# EasyEDA Pro project zdiy1.eprj, board PCB1
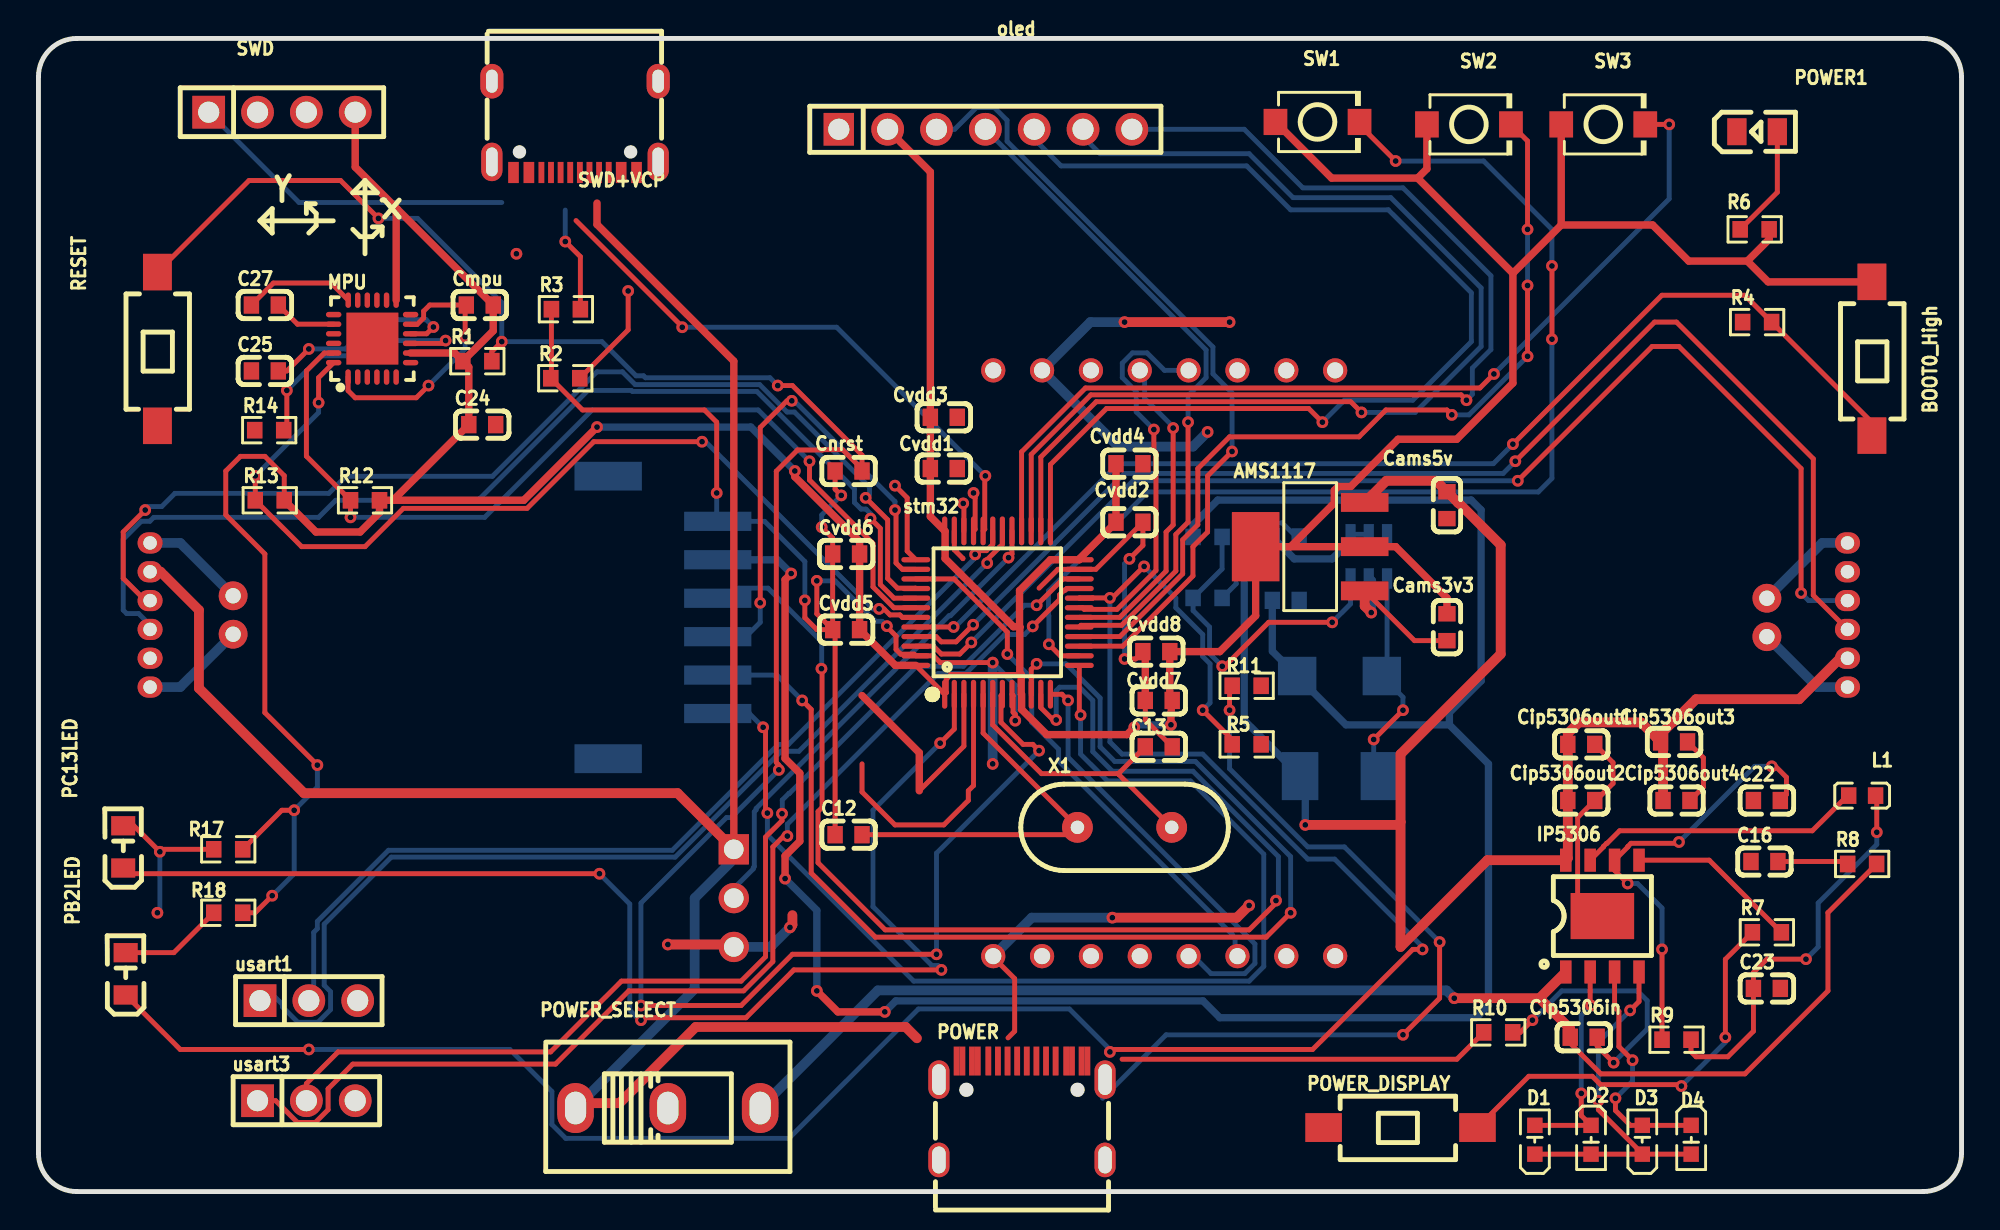
[diagram p2: board, top side]
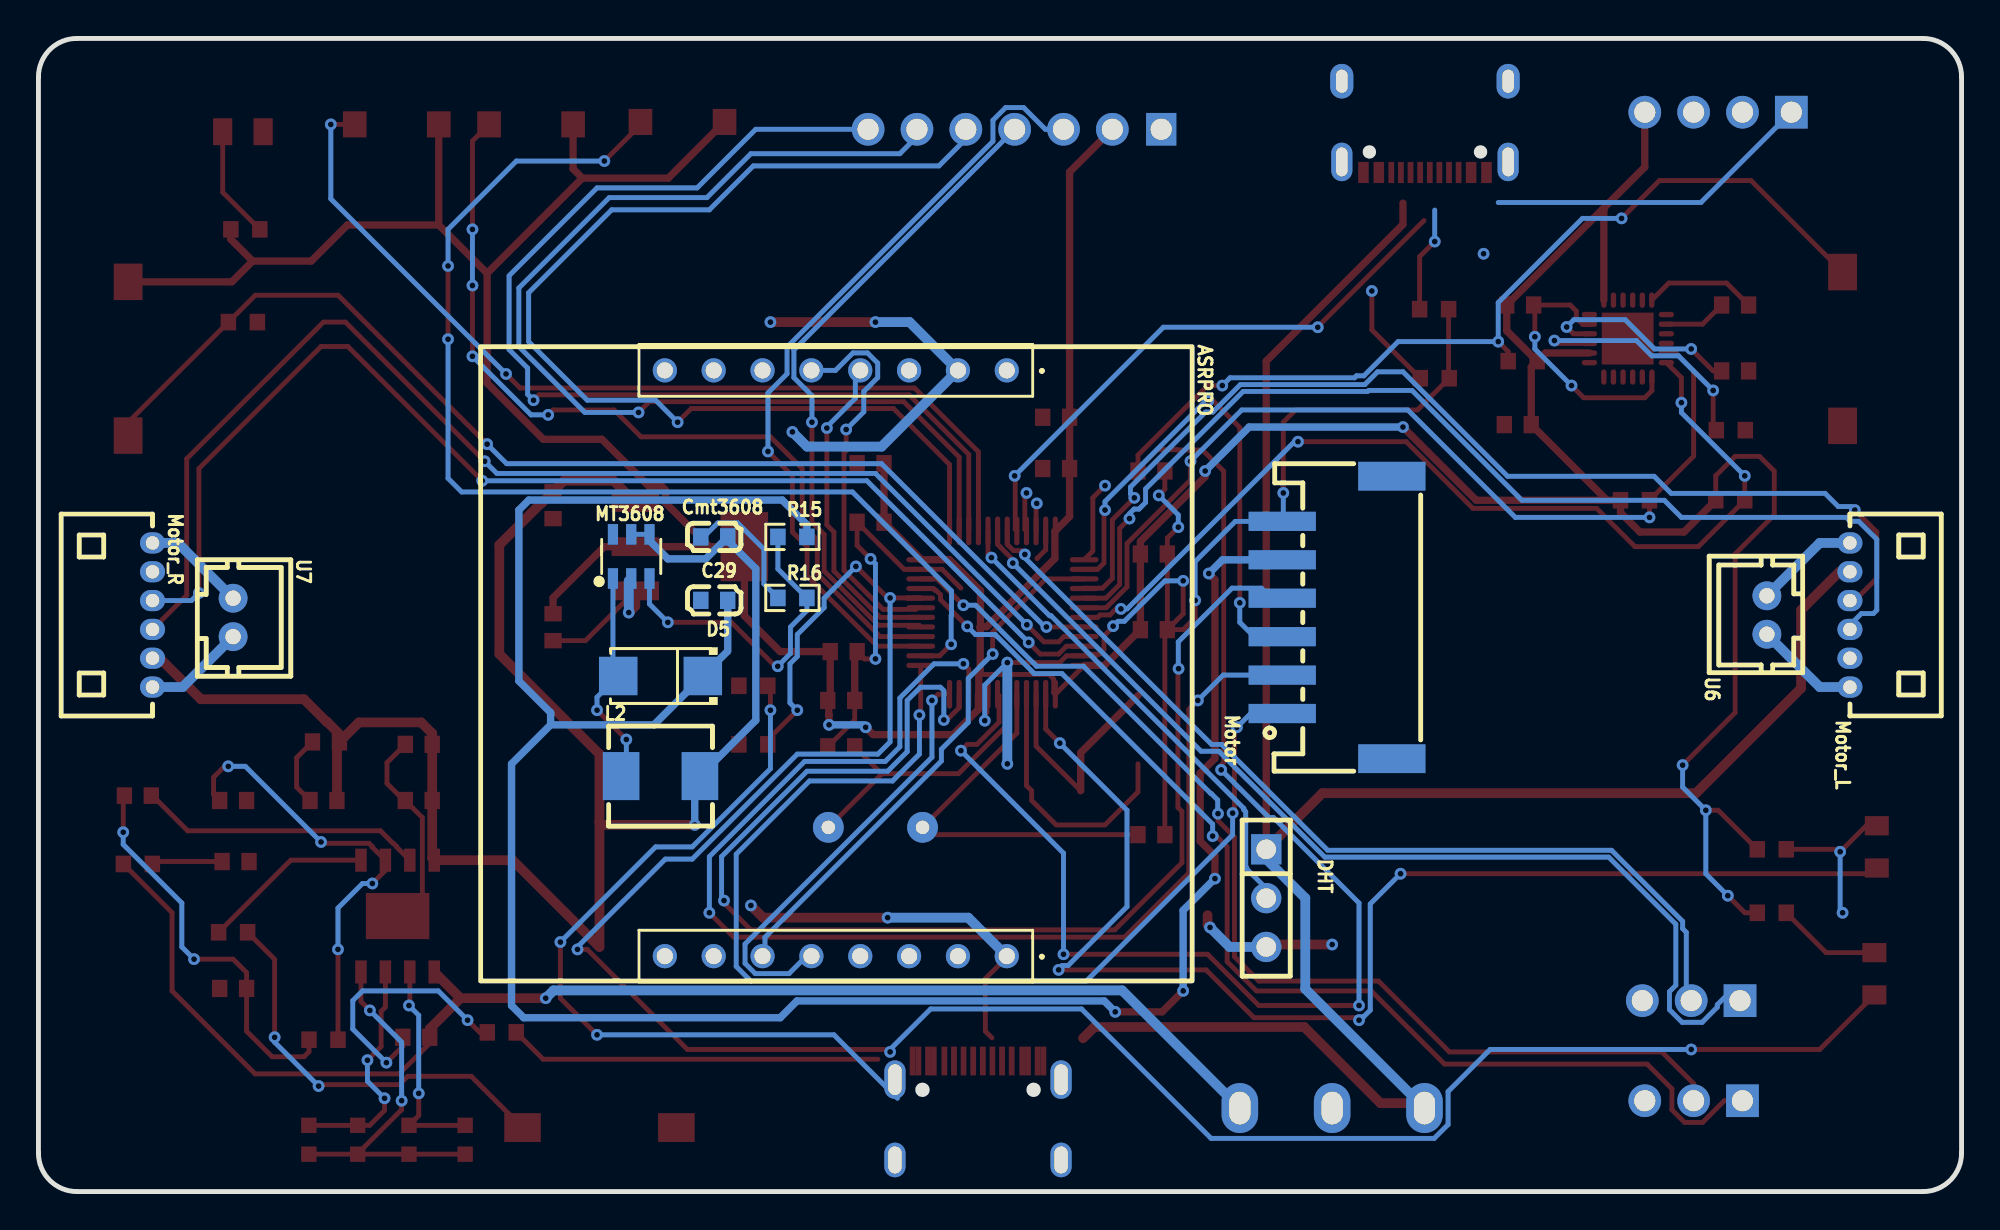
[diagram p3: board, bottom side, seen from below]

Outline 100 x 60 mm; copper layers: Top Layer, Bottom Layer. Coordinates in mm from the lower left corner of the outline.
Outline path: 0,58 0,2 arc(0.59,0.59) 2,0 98,0 arc(99.41,0.59) 100,2 100,58 arc(99.41,59.41) 98,60 2,60 arc(0.59,59.41) 0,58
Stack: Top Layer 0.035mm / Dielectric1 1.51mm FR4 er 4.5 / Bottom Layer 0.035mm

## Design rules (mm)
template: 自定义配置
spacing copperThickness1oz (default): track to track 0.102, other pairs 0.152 to 0.3
spacing copperThickness2oz: track to track 0.203, other pairs 0.152 to 0.3
track width copperThickness1oz (default): min 0.127, default 0.254, max 2.54
track width copperThickness2oz: min 0.203, default 0.254, max 2.54
differential pair differentialPair (default): width min 0.127, default 0.254, max 2.54; gap min 0.152, default 0.152
via viaSize (default): diameter min 0.5, default 0.61, max 10; hole min 0.3, default 0.305, max 6.3
net GND uses copperRegion2

## Placement (name value [footprint] x y rotation side)
AMS1117  AMS1117-3.3  [SOT-223-4_L6.5-W3.5-P2.30-LS7.0-BR]  66.13 33.56 0 top
ASRPRO  ASRPRO  [asrpro_fz]  58.51 27.46 270 bottom
BOOT0_High  TS-1101-C-W  [SW-SMD_L6.0-W3.3-LS8.0]  95.34 43.33 90 top
C12  20pF  [C0603]  42.13 18.57 0 top
C13  20pF  [C0603]  58.25 23.14 180 top
C16  10uF  [C0603]  89.75 17.17 0 top
C22  22uF  [C0603]  89.88 20.35 0 top
C23  22uF  [C0603]  89.88 10.57 0 top
C24  10pF  [C0603]  23.08 39.91 0 top
C25  100pF  [C0603]  11.77 42.7 0 top
C27  2.2uF  [C0603]  11.77 46.13 0 top
C29  22uF  [C0603]  64.86 30.76 180 bottom
Cams3v3  100nF  [C0603]  73.24 29.36 270 top
Cams5v  100nF  [C0603]  73.24 35.72 270 top
Cip5306in  10uF  [C0603]  80.35 8.03 180 top
Cip5306out1  22uF  [C0603]  80.23 23.27 0 top
Cip5306out2  22uF  [C0603]  80.23 20.35 0 top
Cip5306out3  22uF  [C0603]  85.05 23.4 0 top
Cip5306out4  22uF  [C0603]  85.18 20.35 0 top
Cmpu  100pF  [C0603]  22.95 46.13 0 top
Cmt3608  22uF  [C0603]  64.86 34.06 180 bottom
Cnrst  100nF  [C0603]  42.13 37.49 180 top
Cvdd1  100nF  [C0603]  47.08 37.62 180 top
Cvdd2  100nF  [C0603]  56.73 34.83 180 top
Cvdd3  100nF  [C0603]  47.08 40.29 180 top
Cvdd4  100nF  [C0603]  56.73 37.87 180 top
Cvdd5  100nF  [C0603]  42 29.24 0 top
Cvdd6  4.7uF  [C0603]  42 33.17 0 top
Cvdd7  1uF  [C0603]  58.25 25.56 0 top
Cvdd8  10nF  [C0603]  58.13 28.09 180 top
D1  XL-J1608UGC-06  [LED-SMD_XL-J1608UYC-06]  77.81 2.69 270 top
D2  XL-J1608UGC-06  [LED-SMD_XL-J1608UYC-06]  80.73 2.69 90 top
D3  XL-J1608UGC-06  [LED-SMD_XL-J1608UYC-06]  83.4 2.69 270 top
D4  XL-J1608UGC-06  [LED-SMD_XL-J1608UYC-06]  85.94 2.69 90 top
D5  SS34  [SMA_L4.3-W2.6-LS5.2-RD]  67.65 26.83 0 bottom
DHT  PM254V-11-03-H85  [HDR-TH_3P-P2.54-V-F]  36.16 15.27 270 bottom
IP5306  IP5306  [ESOP-8_L4.9-W3.9-P1.27-LS6.0-BL-EP]  81.32 14.33 0 top
L1  1uH  [L0603]  94.83 20.6 0 top
L2  4.7uH  [IND-SMD_L5.4-W5.2_FXL0530]  67.65 21.62 180 bottom
Motor  WAFER-PH2.0-6PWB  [CONN-SMD_6P-P2.00_XUNPU_WAFER-PH2.0-6PWB]  32.47 29.87 90 bottom
Motor_L  HC-ZH1.5-6AW  [CONN-TH_6P-P1.50_HCTL_C-ZH1.5-6AW]  5.8 30 90 bottom
Motor_R  HC-ZH1.5-6AW  [CONN-TH_6P-P1.50_HCTL_C-ZH1.5-6AW]  94.07 30 270 bottom
MPU  MPU-6050  [QFN-24_L4.0-W4.0-P0.50-BL-EP2.7]  17.35 44.38 0 top
MT3608  MT3608  [SOT-23-6_L2.9-W1.6-P0.95-LS2.8-BL]  69.18 33.05 180 bottom
oled  PM254V-11-07-H85  [HDR-TH_7P-P2.54-V-F]  49.24 55.27 0 top
PB2LED  XL-2012UBC  [LED0805-RD]  4.53 11.33 90 top
PC13LED  XL-2012UBC  [LED0805-RD]  4.41 17.94 90 top
POWER  TYPE-C母座16P不绣钢  [TYPE-C-SMD_16P-EH4]  51.14 4.22 0 top
POWER1  NCD0805R1  [LED0805-R-RD]  89.37 55.15 0 top
POWER_DISPLAY  TS-1101-C-W  [SW-SMD_L6.0-W3.3-LS8.0]  70.83 3.33 0 top
POWER_SELECT  SS-12D10G3-G  [SW-TH_3P-L12.7-W6.7-P4.80_SS-12D10G10-G]  32.73 4.35 0 top
R1  5.1K  [R0603]  22.82 43.21 0 top
R2  4.3kΩ  [R0603]  27.39 42.32 0 top
R3  3.9kΩ  [R0603]  27.43 45.91 0 top
R4  4.7kΩ  [R0603]  89.37 45.24 0 top
R5  4.7kΩ  [R0603]  62.83 23.27 180 top
R6  4.7kΩ  [R0603]  89.24 50.07 180 top
R7  10kΩ  [R0603]  89.88 13.49 0 top
R8  2Ω  [R0603]  94.83 17.05 0 top
R9  500mΩ  [R0603]  85.18 7.9 0 top
R10  5.1kΩ  [R0603]  75.91 8.28 0 top
R11  5.1kΩ  [R0603]  62.83 26.32 180 top
R12  4.7kΩ  [R0603]  16.98 35.97 0 top
R13  4.7kΩ  [R0603]  12.03 35.97 0 top
R14  4.7kΩ  [R0603]  12 39.62 0 top
R15  9kΩ  [R0603]  60.79 34.06 180 bottom
R16  1kΩ  [R0603]  60.79 30.89 180 bottom
R17  4.7kΩ  [R0603]  9.87 17.81 180 top
R18  4.7kΩ  [R0603]  9.87 14.51 180 top
RESET  TS-1101-C-W  [SW-SMD_L6.0-W3.3-LS8.0]  6.19 43.84 90 top
stm32  STM32F103C8T6  [LQFP-48_L7.0-W7.0-P0.50-LS9.0-BL]  49.87 30.13 0 top
SW1  TS-1088R-02026  [SW-SMD_L3.9-W3.0-P4.45]  66.51 55.65 0 top
SW2  TS-1088R-02026  [SW-SMD_L3.9-W3.0-P4.45]  74.38 55.53 0 top
SW3  TS-1088R-02026  [SW-SMD_L3.9-W3.0-P4.45]  81.37 55.53 0 top
SWD  2.54-1*4P母  [HDR-TH_4P-P2.54-V-F]  12.66 56.16 0 top
SWD+VCP  TYPE-C 16PIN 2MD(073)  [USB-C-SMD_TYPE-C-6PIN-2MD-073]  27.9 55.4 180 top
U6  WAFER-PH2.0-2PZZ  [CONN-TH_2P-P2.00_HC-PH-2A-M]  10.12 30 90 bottom
U7  WAFER-PH2.0-2PZZ  [CONN-TH_2P-P2.00_HC-PH-2A-M]  89.88 29.87 270 bottom
usart1  PZ254V-11-03P  [HDR-TH_3P-P2.54-V-M]  14.06 9.93 0 top
usart3  PZ254V-11-03P  [HDR-TH_3P-P2.54-V-M]  13.93 4.73 0 top
X1  8MHz  [OSC-TH_L10.0-W4.5-P5.00]  56.48 18.95 90 top

## Footprints (pads in the part's own frame, mm; a bottom-side part is the same pattern mirrored in y, then rotated)
asrpro_fz
  round 1.26 hole 0.84: 1(-15.269,8.861) 2(-15.269,6.321) 3(-15.269,3.781) 4(-15.269,1.241) 5(-15.269,-1.299) 6(-15.269,-3.839) 7(-15.269,-6.379) 8(-15.269,-8.919) 9(15.211,-8.919) 10(15.211,-6.379) 11(15.211,-3.839) 12(15.211,-1.299) 13(15.211,1.241) 14(15.211,3.781) 15(15.211,6.321) 16(15.211,8.861)
C0603
  rect 0.8x0.9 smd: 1(-0.7,0) 2(0.7,0)
CONN-SMD_6P-P2.00_XUNPU_WAFER-PH2.0-6PWB
  rect 1x3.5 smd: 1(-5,2.85) 2(-3,2.85) 3(-1,2.85) 4(1,2.85) 5(3,2.85) 6(5,2.85)
  rect 1.5x3.5 smd: 7(-7.35,-2.85) 8(7.35,-2.85)
CONN-TH_2P-P2.00_HC-PH-2A-M
  round 1.5 hole 0.8: 1(-1,0) 2(1,0)
CONN-TH_6P-P1.50_HCTL_C-ZH1.5-6AW
  oval 1.1x1.3 hole 0.7: 1(-3.75,0) 2(-2.25,0) 3(-0.75,0) 4(0.75,0) 5(2.25,0) 6(3.75,0)
ESOP-8_L4.9-W3.9-P1.27-LS6.0-BL-EP
  rect 0.6x1.2 smd: 1(-1.905,-2.909) 2(-0.635,-2.909) 3(0.635,-2.909) 4(1.905,-2.909) 5(1.905,2.909) 6(0.635,2.909) 7(-0.635,2.909) 8(-1.905,2.909)
  rect 3.3x2.4 smd: 9(0,0)
HDR-TH_3P-P2.54-V-F
  rect 1.575x1.575 hole 1.02: 1(-2.54,0)
  round 1.575 hole 1.02: 2(0,0) 3(2.54,0)
HDR-TH_3P-P2.54-V-M
  rect 1.7x1.7 hole 1.1: 1(-2.54,0)
  round 1.7 hole 1.1: 2(0,0) 3(2.54,0)
HDR-TH_4P-P2.54-V-F
  rect 1.7x1.7 hole 1.1: 1(-3.81,0)
  round 1.7 hole 1.1: 2(-1.27,0) 3(1.27,0) 4(3.81,0)
HDR-TH_7P-P2.54-V-F
  rect 1.575x1.7 hole 1.1: 1(-7.62,0)
  round 1.7 hole 1.1: 2(-5.08,0) 3(-2.54,0) 4(0,0) 5(2.54,0) 6(5.08,0) 7(7.62,0)
IND-SMD_L5.4-W5.2_FXL0530
  rect 1.9x2.5 smd: 1(-2.05,0) 2(2.05,0)
L0603
  rect 0.8x0.864 smd: 1(-0.7,0) 2(0.7,0)
LED0805-R-RD
  rect 1x1.399 smd: 1(1.05,0) 2(-1.05,0)
LED0805-RD
  rect 1x1.25 smd: 1(-1.1,0) 2(1.1,0)
LED-SMD_XL-J1608UYC-06
  rect 0.8x0.8 smd: 1(0.75,0) 2(-0.75,0)
LQFP-48_L7.0-W7.0-P0.50-LS9.0-BL
  oval 0.27x1.5 smd: 1(-2.75,-4.25) 2(-2.25,-4.25) 3(-1.75,-4.25) 4(-1.25,-4.25) 5(-0.75,-4.25) 6(-0.25,-4.25) 7(0.25,-4.25) 8(0.75,-4.25) 9(1.25,-4.25) 10(1.75,-4.25) 11(2.25,-4.25) 12(2.75,-4.25) 25(2.75,4.25) 26(2.25,4.25) 27(1.75,4.25) 28(1.25,4.25) 29(0.75,4.25) 30(0.25,4.25) 31(-0.25,4.25) 32(-0.75,4.25) 33(-1.25,4.25) 34(-1.75,4.25) 35(-2.25,4.25) 36(-2.75,4.25)
  oval 1.5x0.27 smd: 13(4.25,-2.75) 14(4.25,-2.25) 15(4.25,-1.75) 16(4.25,-1.25) 17(4.25,-0.75) 18(4.25,-0.25) 19(4.25,0.25) 20(4.25,0.75) 21(4.25,1.25) 22(4.25,1.75) 23(4.25,2.25) 24(4.25,2.75) 37(-4.25,2.75) 38(-4.25,2.25) 39(-4.25,1.75) 40(-4.25,1.25) 41(-4.25,0.75) 42(-4.25,0.25) 43(-4.25,-0.25) 44(-4.25,-0.75) 45(-4.25,-1.25) 46(-4.25,-1.75) 47(-4.25,-2.25) 48(-4.25,-2.75)
OSC-TH_L10.0-W4.5-P5.00
  round 1.6 hole 0.7: 1(0,2.45) 2(0,-2.45)
QFN-24_L4.0-W4.0-P0.50-BL-EP2.7
  oval 0.28x0.8 smd: 1(-1.25,-2) 2(-0.75,-2) 3(-0.25,-2) 4(0.25,-2) 5(0.75,-2) 6(1.25,-2) 13(1.25,2) 14(0.75,2) 15(0.25,2) 16(-0.25,2) 17(-0.75,2) 18(-1.242,2)
  oval 0.8x0.28 smd: 7(2,-1.25) 8(2,-0.75) 9(2,-0.25) 10(2,0.25) 11(2,0.75) 12(2,1.25) 19(-2,1.25) 20(-2,0.75) 21(-2,0.25) 22(-2,-0.25) 23(-2,-0.75) 24(-2,-1.25)
  rect 2.7x2.7 smd: 25(0.013,0)
R0603
  rect 0.806x0.864 smd: 1(-0.753,0) 2(0.753,0)
SMA_L4.3-W2.6-LS5.2-RD
  rect 2x2 smd: 1(-2.2,0) 2(2.2,0)
SOT-23-6_L2.9-W1.6-P0.95-LS2.8-BL
  rect 0.532x1.072 smd: 1(-0.95,-1.149) 2(0,-1.149) 3(0.95,-1.149) 4(0.95,1.149) 5(0,1.149) 6(-0.95,1.149)
SOT-223-4_L6.5-W3.5-P2.30-LS7.0-BR
  rect 2.47x0.98 smd: 1(2.835,-2.3) 2(2.835,0) 3(2.835,2.3)
  rect 2.47x3.6 smd: 4(-2.835,0)
SW-SMD_L3.9-W3.0-P4.45
  rect 1.23x1.36 smd: 1(-2.185,0) 2(2.185,0)
SW-SMD_L6.0-W3.3-LS8.0
  rect 1.9x1.5 smd: 1(-4,0) 2(4,0)
SW-TH_3P-L12.7-W6.7-P4.80_SS-12D10G10-G
  oval 1.9x2.6 hole 1.1x1.7: 1(-4.8,0) 2(0,0) 3(4.8,0)
TYPE-C-SMD_16P-EH4
  oval 1.1x2 hole 0.7x1.6: 1(-4.32,1.606) 1(4.32,1.606)
  oval 1.1x1.8 hole 0.7x1.4: 1(-4.32,-2.574) 1(4.32,-2.574)
  rect 0.3x1.5 smd: A1(-3.4,2.573) A4(-2.6,2.573) A5(-1.25,2.573) A6(-0.25,2.573) A7(0.25,2.573) A8(1.25,2.574) A9(2.6,2.574) A12(3.4,2.573) B1(3.1,2.573) B4(2.3,2.574) B5(1.75,2.573) B6(0.75,2.573) B7(-0.75,2.573) B8(-1.75,2.574) B9(-2.3,2.573) B12(-3.1,2.573)
USB-C-SMD_TYPE-C-6PIN-2MD-073
  rect 0.55x1.1 smd: 1(-3.2,2.375) 2(-2.4,2.375) 11(2.4,2.375) 12(3.2,2.375)
  rect 0.3x1.1 smd: 3(-1.75,2.375) 4(-1.25,2.375) 5(-0.75,2.375) 6(-0.25,2.375) 7(0.25,2.375) 8(0.75,2.375) 9(1.25,2.375) 10(1.75,2.375)
  oval 1.1x2 hole 0.6x1.5: 13(-4.325,1.825) 14(4.325,1.825)
  oval 1.2x1.8 hole 0.6x1.2: 13(-4.325,-2.375) 14(4.325,-2.375)

## Nets
As in the schematic.

Pads without a net: ASRPRO 1 3 6 7 8 9 10 13 14; Motor 7 8; MPU 2 3 4 5 6 7 12 14 15 16 17 19 21 22 25; MT3608 6; POWER A6 A7 A8 B6 B7 B8

## Via types
v1: diameter 0.61, hole 0.305, Top Layer to Bottom Layer, 142 vias

## Routing (per net, layer and track width the routed paths; a pad name or vN(x,y) marks a point on that pad's centre or on a via; arc(x,y) is an arc through that point)
3V3: length 265.5
  Top Layer w0.254: v1(12.15,15.39) 11.27,14.51 R18.1 ; 47.21,25.96 47.04,25.96 stm32.48 ; 47.21,25.96 stm32.1 ; 47.21,25.96 47.21,25.97 47.21,26.66 47.45,26.91 51.1,26.91 ; R13.2 12.78,37.25 11.77,38.25 10.5,38.25 9.74,37.49 9.74,35.21 11.77,33.17 11.77,24.92 v1(14.5,22.19) ; R17.1 12.65,19.84 v1(13.3,19.84)
  Top Layer w0.381: 18.44,35.97 R12.2 17.73,35.33 16.73,34.32 14.43,34.32 R13.2 ; 18.44,35.97 C24.1 22.38,42.9 R1.1 ; 18.44,35.97 25.23,35.97 v1(29.04,39.78) ; 65.11,33.56 AMS1117.4 63.29,29.96 61.43,28.09 Cvdd8.1 58.83,25.68 ; 65.11,33.56 67.39,35.83 67.39,36.49 67.59,36.69 68.25,36.69 70.7,39.14 73.75,39.14 76.67,42.06 76.67,47.78 ; 65.11,33.56 AMS1117.2 70.57,33.56 73.24,30.89 Cams3v3.1 ; R1.1 21.64,43.63 MPU.8 ; R1.1 23.65,44.79 Cmpu.2 18.66,51.12 ; 71.72,52.73 76.67,47.78 ; 71.72,52.73 67.25,52.73 SW1.1 ; 71.72,52.73 72.2,53.22 72.2,55.53 ; 76.67,47.78 79.18,50.29 ; 18.66,51.12 16.47,53.31 SWD.4 ; 18.66,51.12 18.6,51.06 MPU.13 ; 51.1,25.9 51.1,26.91 51.03,26.98 51.03,29.36 ; v1(39.33,37.49) 39.33,37.19 42.7,33.83 42.7,29.24 44.56,27.38 stm32.48 ; 88.86,48.42 85.81,48.42 83.94,50.29 79.18,50.29 ; 88.86,48.42 89.94,47.33 BOOT0_High.2 ; 88.86,48.42 90,49.55 R6.1 ; Cvdd4.2 Cvdd2.2 54.12,32.92 stm32.24 52.62,32.88 51.02,31.27 51.02,29.39 ; SW3.1 79.18,50.29 ; 51.03,29.36 51.03,29.38 51.02,29.39 ; 51.03,29.36 51.02,29.39 ; 58.91,25.51 58.91,24.81 58.89,24.79 v1(58.89,24.28) ; stm32.9 51.12,25.09 52.43,23.78 56.6,23.78 v1(56.99,24.16) ; 51.02,29.39 50.69,29.39 47.15,32.94 47.15,34.35 stm32.36 46.38,35.12 Cvdd1.2 Cvdd3.2 46.38,53.05 oled.2
  Bottom Layer w0.254: v1(14.5,22.19) 14.5,21.05 v1(13.3,19.84) 13.3,16.54 v1(12.15,15.39)
  Bottom Layer w0.381: v1(58.89,24.28) 57.11,24.28 v1(56.99,24.16) ; v1(29.04,39.78) 37.05,39.78 v1(39.33,37.49)
6V: length 120.6
  Top Layer w0.381: v1(38.82,16.28) 38.82,17.46 39.59,18.23 39.59,21.77 38.82,22.53 38.82,31.84 v1(39.14,32.16) ; v1(40.47,10.44) 41.57,9.35 v1(44.01,9.35)
  Bottom Layer w0.381: 73.37,24.28 67.99,24.28 D5.1 64.18,28.09 ; 73.37,24.28 75.4,22.25 75.4,9.68 74.76,9.04 61.43,9.04 60.55,9.92 44.58,9.92 v1(44.01,9.35) ; 73.37,24.28 73.37,24.92 75.02,26.57 75.02,35.46 74.5,35.98 61.32,35.98 60.04,34.7 R15.2 ; C29.2 64.16,28.12 ; v1(39.14,32.16) 38.43,32.87 Motor.5 ; v1(38.82,16.28) 40.47,14.63 v1(40.47,10.44)
+5V: length 209.4
  Top Layer w0.381: DHT.1 36.16,43.21 29.04,50.32 29.04,51.43
  Top Layer w0.508: 45.68,7.98 45.1,8.56 34.18,8.56 30.21,4.6 28.18,4.6 POWER_SELECT.1 ; 70.83,19.23 70.83,22.76 76.03,27.97 76.03,33.64 73.86,35.82 73.84,35.82 Cams5v.1 72.67,36.98 70.09,36.98 AMS1117.3 ; 70.83,19.23 70.67,19.08 v1(65.88,19.08) ; 70.83,19.23 70.83,12.73 75.34,17.24 IP5306.8 79.53,17.35 Cip5306out2.1 Cip5306out1.1 79.53,23.84 80.1,24.41 83.34,24.41 84.16,23.59 ; Motor_L.5 6.35,32.25 8.34,30.25 8.34,26.19 13.81,20.73 33.24,20.73 DHT.1 ; 84.16,23.59 Cip5306out3.1 84.48,23.27 Cip5306out4.1 ; 84.16,23.59 84.16,23.61 84.99,24.44 85.02,24.44 86.19,25.62 91.56,25.62 93.69,27.75 Motor_R.5
  Bottom Layer w0.254: MT3608.5 MT3608.4
  Bottom Layer w0.381: v1(65.88,19.08) 65.88,21.35 62.7,24.52 62.7,32.41 64.16,33.87 Cmt3608.2 65.3,32.92 67.27,32.92 68.23,33.88 MT3608.4
  Bottom Layer w0.508: DHT.1 36.16,17.3 34.12,15.27 34.12,10.54 POWER_SELECT.1
GND: length 201.1
  Top Layer w0.254: Cip5306out1.2 81.88,22.32 81.88,21.24 80.99,20.35 Cip5306out2.2 80.04,19.46 80.04,14.99 80.69,14.33 IP5306.9 ; v1(56.73,32.92) 57.43,33.62 57.43,34.83 54.98,32.38 stm32.23 53.01,32.38 52.03,31.4 ; Cip5306in.1 81.05,7.56 v1(81.91,6.71) ; ASRPRO.16 49.65,12.19 50.76,11.08 50.76,8.34 50.42,8 ; v1(20.28,41.94) 19.65,41.3 16.47,41.3 16.1,41.67 MPU.1 ; v1(39.85,30.76) 39.85,29.86 40.47,29.24 Cvdd5.1 ; Cvdd5.1 41.43,29.11 C12.1 ; Cvdd5.1 40.47,30.06 v1(40.47,31.78) ; Cvdd5.1 Cvdd6.1 41.3,34 v1(40.73,34.57) ; 48.07,32.93 48.07,32.95 47.62,33.39 stm32.35 ; v1(50.79,24.5) 50.79,24.82 50.68,24.94 50.68,25.82 stm32.8 ; v1(44.12,29.42) 44.12,29.38 44.59,28.91 44.59,28.21 44.84,27.96 45.54,27.96 stm32.47 46.54,27.88 46.89,27.52 v1(49.62,27.52) ; Cnrst.2 41.43,36.54 v1(41.75,36.22) ; v1(35.27,36.35) 35.27,40.03 34.63,40.67 28.29,40.67 R2.1 26.67,42.35 R3.1 ; Cip5306out3.2 86.58,22.57 86.58,21.05 Cip5306out4.2 ; Cams3v3.2 71.56,28.67 AMS1117.1 ; MPU.11 19.37,45.11 19.68,45.11 20.03,45.46 20.03,45.81 20.35,46.13 Cmpu.1 22.19,46.07 v1(22.19,44.48) ; 58.96,23.14 57.56,24.54 Cvdd7.1 ; v1(56.48,27.71) 57.05,27.71 Cvdd8.2 ; R10.2 77.05,8.28 v1(77.69,8.92)
  Top Layer w0.381: Cvdd8.2 57.56,27.97 Cvdd7.1
  Top Layer w0.508: 39.21,14.38 39.21,13.87 v1(39.08,13.74) ; v1(55.84,14.25) 62.32,14.25 v1(62.95,14.89) ; v1(69.3,30.13) 68.96,30.47 AMS1117.1 ; v1(56.48,45.24) v1(61.94,45.24) ; DHT.3 36.03,12.86 v1(32.73,12.86)
  Bottom Layer w0.254: v1(39.85,30.76) 39.85,32.78 37.76,34.87 Motor.6 35.27,34.93 v1(35.27,36.35) ; v1(22.19,44.48) 22.19,43.84 v1(20.28,41.94) ; v1(77.69,8.92) 79.21,10.44 83.15,10.44 83.66,9.93 83.66,8.45 v1(81.91,6.71) ; v1(56.73,32.92) 56.48,32.67 v1(56.48,27.71) ; v1(49.62,27.52) 50.79,26.35 v1(50.79,24.5) ; Cmt3608.1 65.4,34.06 64.67,34.79 63.64,34.79 62.28,33.43 62.28,31.62 R16.1 ; v1(40.47,31.78) 41.43,31.78 43.53,29.67 43.87,29.67 v1(44.12,29.42) ; v1(41.75,36.22) 40.73,35.21 v1(40.73,34.57)
  Bottom Layer w0.508: v1(56.48,45.24) 54.7,45.24 ASRPRO.2 56.15,38.76 60.03,38.76 v1(60.79,39.53) ; DHT.3 38.06,12.73 v1(39.08,13.74) ; v1(55.84,14.25) 51.65,14.25 ASRPRO.16 ; v1(49.62,27.52) v1(49.62,22.25) ; v1(69.3,30.13) 69.3,31.77 MT3608.2
  vias: v1(24.85,48.8)
ASRPRO_PA0: length 16.8
  Top Layer w0.254: v1(59,39.73) 59,34.69 58.64,34.32 58.64,32.29 56.23,29.88 stm32.18
  Bottom Layer w0.254: ASRPRO.4 57.52,42.47 57.52,41.27 59,39.79 v1(59,39.73)
ASRPRO_PA1: length 20.4
  Top Layer w0.254: v1(58,39.65) 58,38.55 58.11,38.44 58.11,32.32 56.08,30.29 54.38,30.29 54.29,30.38 stm32.19
  Bottom Layer w0.254: ASRPRO.5 58.55,42.73 57.65,43.64 56.89,43.64 56.36,43.11 56.36,42.35 57.08,41.63 57.08,40.57 v1(58,39.65)
ASRPRO_PA2: length 23.1
  Top Layer w0.254: stm32.12 53.22,25.88 v1(53.54,25.56)
  Bottom Layer w0.254: v1(53.54,25.56) 53.54,22.6 63.26,12.88 63.26,11.87 62.72,11.34 60.97,11.34 59.68,12.63
ASRPRO_PA3: length 27.3
  Top Layer w0.254: v1(50.38,27.97) 50.38,29.11 47.62,31.88 stm32.39
  Bottom Layer w0.254: 62.22,12.63 62.22,13.23 53.05,22.4 53.05,23.02 51.65,24.41 51.65,26.7 v1(50.38,27.97)
BAT: length 20.7
  Top Layer w0.254: v1(95.59,18.7) 95.59,20.54 95.53,20.6 ; R9.2 85.93,7.28 86.19,7.01 87.85,7.01 89.18,8.34 C23.1 89.18,11.39 89.88,12.09 v1(91.91,12.09)
  Bottom Layer w0.254: v1(95.59,18.7) 95.59,18.06 92.54,15.01 92.54,12.73 v1(91.91,12.09)
BOOT0: length 60.3
  Top Layer w0.254: v1(76.67,38.89) 84.42,46.64 88.73,46.64 R4.2 95.34,40.02 BOOT0_High.1 ; stm32.44 v1(47.59,29.38)
  Bottom Layer w0.254: v1(76.67,38.89) 75.65,37.87 56.16,37.87 47.66,29.38 v1(47.59,29.38)
BOOT1: length 122.1
  Top Layer w0.254: v1(71.97,12.6) 71.46,12.6 66.26,7.39 55.84,7.39 v1(55.72,7.27) ; v1(57.49,32.53) 57.48,32.53 55.84,30.89 54.84,30.89 ; 54.84,30.89 54.13,30.89 stm32.20 54.82,30.88 54.84,30.89 ; v1(14.06,7.39) 7.37,7.39 PB2LED.1 ; v1(60.54,25.05) 62.07,23.51 R5.2
  Bottom Layer w0.254: v1(14.06,7.39) 24.51,7.39 26.7,5.21 26.7,3.49 27.42,2.77 39.02,2.77 45.76,9.5 53.61,9.5 55.72,7.39 v1(55.72,7.27) ; v1(57.49,32.53) 59.14,30.88 59.14,30.38 60.54,28.98 60.54,27.85 60.92,27.46 60.92,25.43 v1(60.54,25.05) ; v1(55.72,30.89) 55.72,23.4 56.35,22.76 60.54,22.76 66,17.3 67.4,17.3 71.97,12.73 v1(71.97,12.6)
DHT_DAT: length 25.1
  Top Layer w0.254: stm32.29 50.62,33.16 v1(50.44,32.98)
  Bottom Layer w0.254: DHT.2 36.16,15.78 37.17,16.79 37.17,16.85 37.22,16.91 37.22,19.76 37.32,19.86 37.32,19.94 47.34,29.96 47.42,29.96 v1(50.44,32.98)
ENCODER_LA: length 56
  Top Layer w0.254: v1(5.55,35.46) 4.41,34.32 4.41,31.91 5.56,30.75 Motor_L.4 ; v1(43.02,36.1) 44.16,34.95 44.16,31.91 44.67,31.4 45.6,31.4 stm32.40
  Bottom Layer w0.254: v1(43.02,36.1) 43.22,36.3 43.22,36.66 39.31,40.56 38.93,40.56 37.5,41.99 31.03,41.99 30.37,42.65 29.04,42.65 23.61,37.22 15.99,37.22 15.1,36.33 7.1,36.33 6.41,35.64 5.73,35.64 v1(5.55,35.46)
ENCODER_LB: length 56.8
  Top Layer w0.254: v1(43.27,35.02) 43.78,34.51 43.78,31.58 44.48,30.88 stm32.41
  Bottom Layer w0.254: v1(43.27,35.02) 43.27,35.27 43.03,35.51 42.77,35.51 42.43,35.85 42.43,36.56 37.36,41.63 30.88,41.63 30.83,41.68 28.57,41.68 22.86,35.97 15.46,35.97 14.57,35.08 6,35.08 5.79,34.88 5.35,34.88 4.41,33.94 4.41,30.25 4.59,30.07 5.21,30.07 5.8,29.48 Motor_L.3
ENCODER_RA: length 66.2
  Top Layer w0.254: stm32.45 46.68,28.88 46.95,28.6 47.71,28.6 v1(48.6,29.49) ; v1(76.8,38) 84.04,45.24 85.18,45.24 92.29,38.13 92.29,31.03 Motor_R.4
  Bottom Layer w0.254: v1(76.8,38) 76.16,37.37 56.48,37.37 v1(48.6,29.49)
ENCODER_RB: length 64.5
  Top Layer w0.254: v1(48.51,28.57) 47.91,27.97 46.95,27.97 46.54,28.38 stm32.46 ; v1(91.66,31.14) 91.66,37.62 85.31,43.97 83.91,43.97 v1(76.92,36.98)
  Bottom Layer w0.254: v1(91.66,31.14) 92.05,30.75 Motor_R.3 ; v1(48.51,28.57) 56.92,36.98 v1(76.92,36.98)
IP5306_IN: length 71.7
  Top Layer w0.254: R8.2 93.05,14.51 93.05,10.44 88.74,6.12 81.24,6.12 79.65,7.71 79.65,8.03
  Top Layer w0.508: 79.65,8.03 79.65,8.46 78.06,10.06 ; 78.06,10.06 IP5306.1 ; 78.06,10.06 v1(73.62,10.06)
  Bottom Layer w0.508: v1(73.62,10.06) 73.22,10.47 43.65,10.47 POWER_SELECT.3
L+: length 5.5
  Bottom Layer w0.508: U6.2 7.37,33.75 Motor_L.6
L-: length 5.5
  Bottom Layer w0.508: Motor_L.1 7.37,26.25 U6.1
L_PWM: length 64.4
  Top Layer w0.254: v1(51.91,27.46) 51.62,27.18 stm32.10 ; v1(39.71,25.56) 40.18,25.09 40.18,16.58 43.52,13.24 63.84,13.24 v1(65.11,14.51)
  Bottom Layer w0.254: Motor.2 38.4,26.87 v1(39.71,25.56) ; v1(65.11,14.51) 65.11,17.43 60.16,22.38 55.97,22.38 55.21,23.14 55.21,25.68 53.43,27.46 v1(51.91,27.46)
L_TURN: length 59.8
  Top Layer w0.254: v1(37.9,19.69) 37.81,19.79 37.81,24.03 v1(37.68,24.16) ; stm32.13 54.12,24.86 v1(54.19,24.79)
  Bottom Layer w0.254: v1(37.68,24.16) 36.97,24.87 Motor.1 ; v1(37.9,19.69) 37.9,18.56 45.51,10.95 62.95,10.95 63.72,11.71 63.72,17.55 59.91,21.36 55.59,21.36 54.19,22.76 v1(54.19,24.79)
NRST: length 117.4
  Top Layer w0.254: v1(38.44,41.94) 39.21,41.94 42.83,38.32 42.83,37.59 ; RESET.2 10.95,52.61 15.71,52.61 v1(17.68,50.64) ; v1(38.5,21.94) 38.5,22.2 38.37,22.33 38.37,37.48 39.47,38.58 40.77,38.58 40.78,38.6 41.81,38.6 42.83,37.59 ; stm32.7 50.05,25.81 50.05,24.42 51.2,23.27 51.71,23.27 v1(52.03,22.94) ; v1(46.7,12.35) 39.21,12.35 36.54,9.68 v1(31.33,9.68) ; R1.2 23.58,43.71 v1(24.09,44.22) ; 42.83,37.59 Cnrst.1
  Bottom Layer w0.254: v1(17.68,50.64) 19.71,50.64 24.09,46.26 v1(24.09,44.22) 29.3,44.22 31.08,42.45 31.46,42.45 31.56,42.34 38.04,42.34 v1(38.44,41.94) ; v1(52.03,22.94) 46.7,17.61 v1(46.7,12.35) ; v1(38.5,21.94) 36.02,19.46 35.78,19.46 31.33,15.01 v1(31.33,9.68)
OLED_CS: length 56.8
  Top Layer w0.254: v1(74.26,41.18) 73.98,41.45 54.72,41.45 51.62,38.35 stm32.27
  Bottom Layer w0.254: oled.7 62.7,55.27 65.75,52.22 70.96,52.22 75.53,47.65 75.53,43.81 74.56,42.85 74.56,41.48 v1(74.26,41.18)
OLED_DC: length 57
  Top Layer w0.254: stm32.26 52.12,38.22 55,41.1 68.24,41.1 v1(68.8,40.54)
  Bottom Layer w0.254: v1(68.8,40.54) 71.59,40.54 75.02,43.97 75.02,47.02 70.32,51.72 65.24,51.72 62.95,54 55.21,54 54.32,54.89 oled.6
OLED_RES: length 57.7
  Top Layer w0.254: v1(66.76,40.03) 66.05,40.74 55.54,40.74 52.62,37.83 stm32.25
  Bottom Layer w0.254: oled.5 51.78,54.77 53.18,53.37 62.83,53.37 65.11,51.08 70.19,51.08 74.51,46.76 74.51,44.22 71.46,41.18 67.91,41.18 v1(66.76,40.03)
OSC32_IN: length 12.2
  Top Layer w0.254: 45.8,20.86 48.12,23.17 stm32.3
  Top Layer w0.381: 42.83,25.81 45.8,22.83 45.8,20.86
OSC32_OUT: length 13.9
  Top Layer w0.254: stm32.4 48.62,21.12 48.35,20.86 48.35,20.35 47.08,19.08 44.54,19.08 42.83,20.79 42.83,22.25
OSC_IN: length 20.3
  Top Layer w0.254: C12.2 53.65,18.57 X1.1 49.12,23.86 stm32.5
OSC_OUT: length 15.1
  Top Layer w0.254: stm32.6 49.62,24.28 52.16,21.75 56.13,21.75 56.18,21.7 ; C13.2 56.18,21.77 56.18,21.7 ; X1.2 56.18,21.7
PA1: length 66.8
  Top Layer w0.254: v1(52.92,24.54) 52.76,24.54 52.12,25.18 stm32.11 ; v1(40.72,27.21) 40.75,27.17 40.75,19.98 40.54,19.78 40.54,17.11 44.03,13.62 62.95,13.62 64.35,15.01 v1(64.35,15.14)
  Bottom Layer w0.254: v1(64.35,15.14) 64.48,15.27 64.48,17.43 60.03,21.87 55.84,21.87 54.83,22.89 54.83,25.56 54.14,26.24 53.1,26.24 52.92,26.06 v1(52.92,24.54) ; v1(40.72,27.21) 40.73,27.22 40.73,28.6 37.94,31.4 36.41,31.4 35.89,30.87 Motor.4
PA4: length 58.6
  Top Layer w0.254: v1(52.54,28.48) 53.14,27.88 stm32.14 ; v1(78.7,44.35) v1(78.7,48.16) ; SW1.2 68.69,55.5 v1(70.57,53.62)
  Bottom Layer w0.254: v1(78.7,48.16) 78.7,50.07 75.15,53.62 v1(70.57,53.62) ; v1(52.54,28.48) 52.54,29.96 52.52,29.98 52.52,31.25 57.67,36.4 77.99,36.4 78.7,37.11 v1(78.7,44.35)
PA5: length 41.2
  Top Layer w0.254: v1(62.06,38.51) 60.79,37.24 60.79,34.32 60.03,33.56 60.03,32.03 56.38,28.38 stm32.15
  Bottom Layer w0.254: oled.3 47.64,55.27 48.77,56.4 49.71,56.4 50.37,55.74 50.37,54.65 61.07,43.94 61.07,42.55 62.06,41.56 v1(62.06,38.51)
PA6: length 44.7
  Top Layer w0.254: v1(73.5,40.41) 73.24,40.67 70.07,40.67 68.67,39.27 61.94,39.27 60.29,37.62 60.29,34.7 59.5,33.91 59.5,32.14 56.23,28.88 stm32.16 ; v1(77.43,50.07) 77.43,54.66 SW2.2 ; v1(77.43,43.46) v1(77.43,47.14)
  Bottom Layer w0.254: v1(77.43,43.46) 74.38,40.41 v1(73.5,40.41) ; v1(77.43,47.14) v1(77.43,50.07)
PA7: length 34.6
  Top Layer w0.254: v1(59.78,40.03) 59.78,34.83 59.14,34.19 59.14,32.29 56.32,29.46 54.21,29.46 stm32.17
  Bottom Layer w0.254: oled.4 60.72,43.79 60.72,42.35 59.78,41.41 v1(59.78,40.03)
PA9: length 53.7
  Top Layer w0.254: v1(49.33,32.7) 49.33,32.88 49.98,33.53 49.98,33.53 50.12,33.68 stm32.30
  Bottom Layer w0.254: 11.52,9.93 11.52,10.04 11.77,10.29 12.13,10.29 12.7,9.72 12.7,9.59 13.49,8.81 14.53,8.81 15.19,9.47 15.19,10.4 14.86,10.73 14.86,13.91 18.35,17.4 33.11,17.4 38.62,22.91 39.54,22.91 v1(49.33,32.7)
PA10: length 48.4
  Top Layer w0.254: stm32.31 49.62,33.68 49.29,33.35 48.9,33.35 v1(48.71,33.15)
  Bottom Layer w0.254: v1(48.71,33.15) 48.71,32.97 39,23.27 38.47,23.27 32.96,17.76 18.2,17.76 14.5,14.06 14.5,13.68 14.31,13.49 14.31,10.19 usart1.2
PA11: length 29.7
  Top Layer w0.254: stm32.32 49.21,34.46 49.21,37.21 v1(49.24,37.24) ; v1(33.48,44.97) 33.48,45 27.95,50.52
  Bottom Layer w0.254: v1(33.48,44.97) 41.5,44.97 v1(49.24,37.24)
PA12: length 2
  Top Layer w0.254: v1(48.62,36.35) 48.62,36.17 48.71,36.08 48.71,34.46 stm32.33
PA13: length 1.4
  Top Layer w0.254: stm32.34 48.12,35.77 v1(48.09,35.81)
PA14: length 21.5
  Top Layer w0.254: v1(44.54,36.73) 45.17,36.1 45.17,33.33 stm32.37
  Bottom Layer w0.254: SWD.1 13.55,51.46 24.09,51.46
PA15: length 26.8
  Top Layer w0.254: stm32.38 44.92,32.38 44.59,32.71 44.59,35.41 v1(44.54,35.46) ; v1(39.17,41.14) 38.92,41.14 37.53,39.76 v1(37.53,30.64)
  Bottom Layer w0.254: v1(37.53,30.64) 37.53,29.62 36.78,28.87 Motor.3 ; v1(44.54,35.46) 44.54,35.91 39.3,41.14 v1(39.17,41.14)
PB6: length 48.2
  Top Layer w0.254: v1(40.09,38) 40.09,37.02 43.4,33.72 43.4,31.46 44.48,30.38 stm32.42 ; MPU.23 14.86,43.63 13.93,42.7 13.93,38.26 R12.1 v1(16.23,35.08)
  Bottom Layer w0.254: v1(40.09,38) 37.43,40.67 28.79,40.67 23.2,35.08 v1(16.23,35.08)
PB7: length 50.3
  Top Layer w0.254: v1(14.57,41.05) 14.57,42.35 MPU.24 ; v1(34.51,39.02) 28.88,39.02 25.41,35.55 18.97,35.55 16.98,33.56 13.69,33.56 R13.1 v1(11.27,37.24) ; stm32.43 45.62,29.87 44.93,29.87 44.8,30 44.28,30 43.97,30.32 v1(43.71,30.32)
  Bottom Layer w0.254: v1(34.51,39.02) 34.69,39.02 43.39,30.32 v1(43.71,30.32) ; v1(11.27,37.24) 14.57,40.53 v1(14.57,41.05)
PB10: length 59.3
  Top Layer w0.254: v1(51.7,29.41) 53.09,30.8 53.09,31.05 53.34,31.29 53.39,31.29 53.47,31.38 stm32.21 ; usart3.1 12.34,4.73 13.46,3.6 14.4,3.6 15.06,4.26 15.06,5.35 16.34,6.63 26.89,6.63 30.7,10.44 36.66,10.44 38.19,11.97 38.19,17.94 38.75,18.5 v1(38.94,18.5)
  Bottom Layer w0.254: v1(51.7,29.41) 51.28,28.98 50.25,28.98 48.22,26.95 46.78,26.95 38.94,19.12 v1(38.94,18.5)
PB11: length 56.2
  Top Layer w0.254: usart3.2 13.93,5.62 15.58,7.27 26.63,7.27 30.31,10.95 36.54,10.95 37.81,12.22 37.81,18.44 38.66,19.3 v1(38.66,19.66) ; v1(51.91,30.51) 53.28,31.88 stm32.22
  Bottom Layer w0.254: v1(38.66,19.66) 38.68,19.68 38.68,20.37 39.02,20.72 39.04,20.72 45.66,27.33 48.1,27.33 51.27,30.51 v1(51.91,30.51)
PB15: length 48.4
  Top Layer w0.254: stm32.28 51.12,38.49 54.44,41.81 74.96,41.81 v1(75.69,42.54) ; v1(84.8,55.53) SW3.2
  Bottom Layer w0.254: v1(84.8,55.53) 84.8,51.65 v1(75.69,42.54)
PC13: length 67.9
  Top Layer w0.254: v1(29.17,16.54) 4.7,16.54 PC13LED.1 ; stm32.2 47.62,24.07 v1(46.89,23.33) ; v1(46.95,11.53) 39.28,11.53 36.79,9.04 31.59,9.04 31.46,8.92 v1(31.33,8.92)
  Bottom Layer w0.254: v1(31.33,8.92) 31.15,9.1 31.09,9.1 30.75,9.44 30.75,14.96 v1(29.17,16.54) ; v1(46.89,23.33) 43.4,19.84 43.4,14.82 46.46,11.76 46.77,11.76 46.95,11.59 v1(46.95,11.53)
R+: length 5.3
  Bottom Layer w0.508: U7.2 92.5,26.25 Motor_R.6
R-: length 5.4
  Bottom Layer w0.508: Motor_R.1 92.75,33.75 U7.1
$1N940: length 41.6
  Top Layer w0.254: v1(70.96,8.16) 72.86,10.06 v1(72.86,12.98) ; R11.2 61.94,26.18 v1(61.94,25.05)
  Bottom Layer w0.254: v1(61.94,25.05) 61.94,22 66,17.94 67.91,17.94 v1(72.86,12.98) ; v1(70.96,8.16) 58.64,8.16 55.33,4.85
$1N945: length 19.4
  Top Layer w0.254: R10.1 73.76,6.89 56.35,6.89
$1N1477: length 13.3
  Top Layer w0.254: v1(12.92,41.68) 12.92,39.78 R14.2 ; MPU.9 21.02,44.13 v1(21.17,44.28)
  Bottom Layer w0.254: v1(21.17,44.28) 16.9,44.28 16.11,43.49 14.72,43.49 v1(12.92,41.68)
$1N1848: length 10.7
  Top Layer w0.254: MPU.10 20.18,44.63 v1(20.54,44.99) ; C25.2 12.92,42.7 v1(14.06,43.84)
  Bottom Layer w0.254: v1(20.54,44.99) 20.16,45.37 17.49,45.37 15.96,43.84 v1(14.06,43.84)
$1N1890: length 3.3
  Top Layer w0.254: C27.2 13.47,45.13 MPU.20
$1N1895: length 5.9
  Top Layer w0.254: C27.1 12.22,47.27 15.22,47.27 MPU.18
$1N5535: length 11.6
  Top Layer w0.254: v1(70.96,25.05) v1(69.43,23.52)
  Bottom Layer w0.254: v1(69.43,23.52) 69.43,21.89 L2.1 ; v1(70.96,25.05) 70.96,25.72 D5.2 70.13,27.1 70.13,31.9
$1N5567: length 17.3
  Top Layer w0.254: v1(67.27,29.62) 63.97,29.62 61.68,27.33 v1(61.56,27.33)
  Bottom Layer w0.254: MT3608.3 68.23,30.57 v1(67.27,29.62) ; R15.1 61.55,32.4 R16.2 60.04,30.23 60.9,29.37 60.9,27.99 v1(61.56,27.33)
$2N1682: length 5.5
  Top Layer w0.254: v1(27.39,49.43) 28.18,48.65 R3.2
  Bottom Layer w0.254: 27.39,51.07 v1(27.39,49.43)
$2N1703: length 5.6
  Top Layer w0.254: R2.2 30.66,44.84 v1(30.66,46.86)
$2N4715: length 9
  Top Layer w0.254: IP5306.5 86.88,17.24 R7.2
$2N4720: length 21.5
  Top Layer w0.254: v1(85.43,5.49) 85.36,5.56 81.23,5.56 80.8,6 77.5,6 POWER_DISPLAY.2 ; R7.1 87.72,12.08 v1(87.72,8.03)
  Bottom Layer w0.254: v1(87.72,8.03) 87.72,7.78 v1(85.43,5.49)
$2N4867: length 3.7
  Top Layer w0.254: R8.1 93.95,17.17 C16.2
$2N5169: length 11.3
  Top Layer w0.254: IP5306.2 80.69,9.72 v1(80.73,9.68) ; D1.2 D2.1 80.23,3.95 v1(80.23,5.11)
  Bottom Layer w0.254: v1(80.73,9.68) 80.23,9.17 v1(80.23,5.11)
$2N5174: length 19.4
  Top Layer w0.254: D3.1 D2.2 D1.1 ; D3.1 D4.2 ; D3.1 83.4,1.97 81.12,4.26 v1(81.12,4.73) ; IP5306.4 83.23,9.89 v1(82.77,9.43)
  Bottom Layer w0.254: v1(81.12,4.73) 81.12,7.78 v1(82.77,9.43)
$2N5218: length 12.2
  Top Layer w0.254: v1(82,4.85) 82,4.22 82.78,3.44 D3.2 D4.1 ; v1(82.89,6.84) 82.18,7.55 82.18,9.38 81.96,9.6 IP5306.3
  Bottom Layer w0.254: v1(82,4.85) 82.89,5.74 v1(82.89,6.84)
$2N5524: length 14.8
  Top Layer w0.254: IP5306.7 81.38,17.93 81.38,17.96 81.54,18.12 81.57,18.12 82.22,18.77 92.24,18.77 94.07,20.6 L1.1
$2N5554: length 23.2
  Top Layer w0.254: v1(82.64,16.03) 81.96,16.71 IP5306.6 82.65,17.93 82.65,17.96 82.81,18.12 85.24,18.12 v1(85.31,18.19) ; v1(90.13,22.13) 90.32,22.13 90.89,21.56 90.89,20.66 C22.2 ; R9.1 v1(84.43,12.6)
  Bottom Layer w0.254: v1(90.13,22.13) 89.24,22.13 v1(85.31,18.19) ; v1(82.64,16.03) 83.15,16.03 84.43,14.75 v1(84.43,12.6)
$2N9914: length 5.9
  Top Layer w0.254: POWER1.1 90.42,52 R6.2
$2N9917: length 5.4
  Top Layer w0.254: R18.2 7.04,12.43 4.53,12.43
$2N9920: length 8.5
  Top Layer w0.254: R17.2 6.44,17.81 v1(6.31,17.68) 4.96,19.03 PC13LED.2
  Bottom Layer w0.254: v1(6.31,17.68) 6.31,14.63 v1(6.19,14.51)
